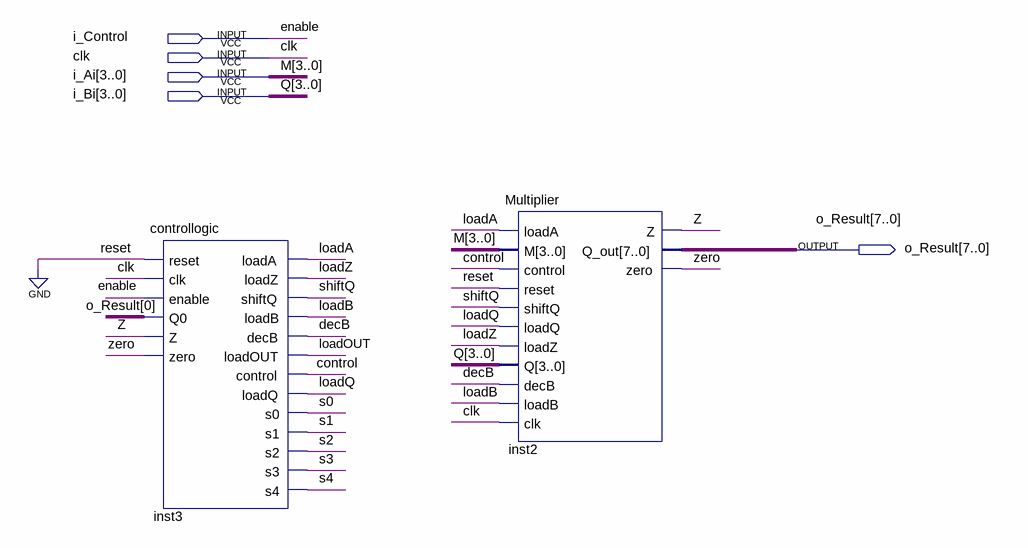
[diagram p0: schematic sheet]
// Quartus schematic multiplier4bit.bdf as structural Verilog: 2 symbols, 5 pins
module multiplier4bit (
  input  i_Control,
  input  clk,
  input  [3:0] i_Ai,
  input  [3:0] i_Bi,
  output [7:0] o_Result
);

  wire control, decB, loadA, loadB, loadOUT, loadQ, loadZ, s0, s1, s2, s3, s4, shiftQ, Z, zero;

  controllogic inst3 (
    .reset(1'b0), .clk(clk), .enable(i_Control), .Q0(o_Result[0]), .Z(Z), .zero(zero), .loadA(loadA),
    .loadZ(loadZ), .shiftQ(shiftQ), .loadB(loadB), .decB(decB), .loadOUT(loadOUT), .control(control),
    .loadQ(loadQ), .s0(s0), .s1(s1), .s2(s2), .s3(s3), .s4(s4));
  Multiplier inst2 (
    .loadA(loadA), .M(i_Ai), .control(control), .reset(1'b0), .shiftQ(shiftQ), .loadQ(loadQ), .loadZ(loadZ),
    .Q(i_Bi), .decB(decB), .loadB(loadB), .clk(clk), .Z(Z), .Q_out(o_Result), .zero(zero));

  // Other names for the same wires on the sheet: enable = i_Control; M[3:0] = i_Ai; Q[3:0] = i_Bi
endmodule
